# EAGLE design temp-pres (EAGLE 7.6.0)
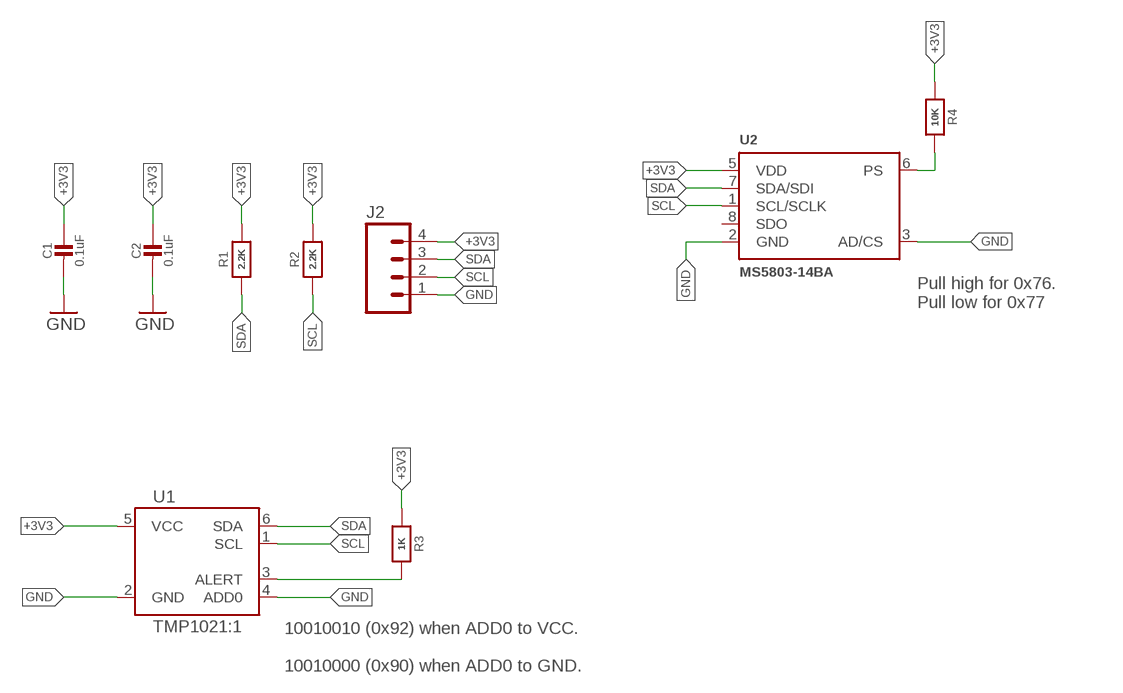
[diagram p0: schematic, sheet 1]

## Parts
C1  0.1uF  CAP_CERAMIC0805-NOOUTLINE  [0805-NO]
C2  0.1uF  CAP_CERAMIC0805-NOOUTLINE  [0805-NO]
J2  M04NO_SILK_ALL_ROUND  [1X04_NO_SILK_ALL_ROUND]
R1  2.2K  RESISTOR_0805MP  [_0805MP]
R2  2.2K  RESISTOR_0805MP  [_0805MP]
R3  1K  RESISTOR_0805MP  [_0805MP]
R4  10K  RESISTOR_0805MP  [_0805MP]
U1  TMP1021:1  [SOT563-2]
U2  MS5803-14BA  [MS5803]

## Nets
+3V3: C1.1 C2.1 J2.4 R1.2 R2.2 R3.1 R4.1 U1.5(VCC) U2.5(VDD)
GND: C1.2 C2.2 J2.1 U1.2(GND) U1.4(ADD0) U2.2(GND) U2.3(AD/CS)
N$1: R3.2 U1.3(ALERT)
PS: R4.2 U2.6(PS)
SCL: J2.2 R2.1 U1.1(SCL) U2.1(SCL/SCLK)
SDA: J2.3 R1.1 U1.6(SDA) U2.7(SDA/SDI)
Unconnected: U2.8(SDO)

## Notes on the sheet
- Pull high for 0x76.
  Pull low for 0x77
- 10010010 (0x92) when ADD0 to VCC.
  
  10010000 (0x90) when ADD0 to GND.

## Library data of the parts
C1 C2 = microbuilder:CAP_CERAMIC: Ceramic Capacitors For new designs, use the packages preceded by an '_' character since they are more reliable: The following footprints should be used on most boards: _0402 - Standard footprint for regular board layouts _0603 - Standard footprint for regular board layouts _0805 - Standard footprint for regular board layouts _1206 - Standard footprint for regular board layouts For extremely tight-pitch boards where space is at a premium, the following 'micro-pitch' footprints can be used (smaller pads, no silkscreen outline, etc.): _0402MP - Micro-pitch footprint for very dense/compact boards _0603MP - Micro-pitch footprint for very dense/compact boards _0805MP - Micro-pitch footprint for very dense/compact boards _1206MP - Micro-pitch footprint for very dense/compact boards
J2 = SparkFun-Connectors:M04: Header 4 Standard 4-pin 0.1" header. Use with straight break away headers (SKU : PRT-00116), right angle break away headers (PRT-00553), swiss pins (PRT-00743), machine pins (PRT-00117), and female headers (PRT-00115). Molex polarized connector foot print use with SKU : PRT-08231 with associated crimp pins and housings. 1MM SMD Version SKU: PRT-10208; PROD_ID: CONN-09696
R1-R4 = microbuilder:RESISTOR: Resistors For new designs, use the packages preceded by an '_' character since they are more reliable: The following footprints should be used on most boards: _0402 - Standard footprint for regular board layouts _0603 - Standard footprint for regular board layouts _0805 - Standard footprint for regular board layouts _1206 - Standard footprint for regular board layouts For extremely tight-pitch boards where space is at a premium, the following 'micro-pitch' footprints can be used (smaller pads, no silkscreen outline, etc.): _0402MP - Micro-pitch footprint for very dense/compact boards _0603MP - Micro-pitch footprint for very dense/compact boards _0805MP - Micro-pitch footprint for very dense/compact boards _1206MP - Micro-pitch footprint for very dense/compact boards
U1 = SparkFun-Sensors:TMP102: I2C degC temp sensor
U2 = MS5803:MS5803-14BA; PROD_ID: IC-12111

## Board
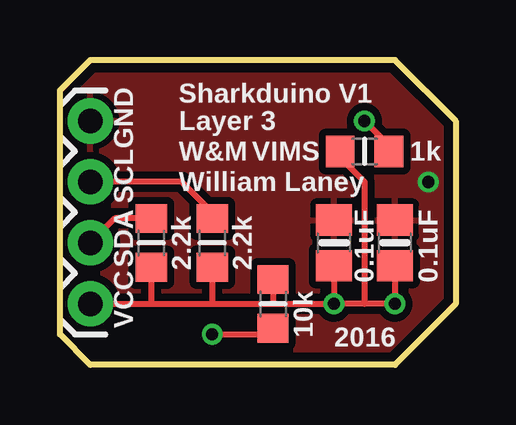
[diagram p1: board, top side]
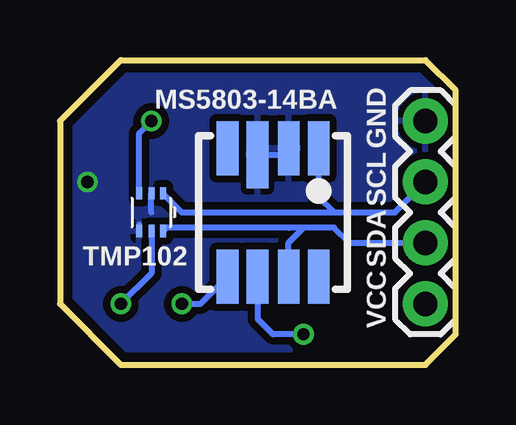
[diagram p2: board, bottom side, seen from below]

Size 16.51 x 12.7 mm. Coordinates in mm from the lower left corner, seen from the top.
Outline: 0,1.27 0,11.43 1.27,12.7 13.97,12.7 16.51,10.16 16.51,2.54 13.97,0 1.27,0 0,1.27
Copper layers (1*16): Top 0.0356mm / dielectric 1.5011mm / Bottom 0.0356mm
Design rules "oshpark-2layer": minimum track width 6mil, minimum drill 13mil, track to track 6mil, track to pad 6mil, pad to pad 6mil, via to via 6mil, smd to smd 6mil, copper to edge 15mil, drill to drill 6mil, minimum pad ring 7mil, minimum via ring 7mil, stop-mask expansion 2.5mil, vias tented up to drill 0mil, thermal gap 10mil

### Footprints (pad centres in the part's own frame; a part is rotated, then mirrored left to right if it is on the bottom)
0805-NO = smd 1.3 x 1.5: 1 -0.95,0; 2 0.95,0
1X04_NO_SILK_ALL_ROUND = drill 1.016 pad 1.88: 1 0,0; 2 2.54,0; 3 5.08,0; 4 7.62,0
_0805MP = smd 1.2 x 1.3: 1 -1.016,0; 2 1.016,0
SOT563-2 = smd 0.508 x 0.249: 1 -0.8,0.498; 2 -0.8,0.003; 3 -0.8,-0.506; 4 0.776,-0.506; 5 0.776,0.003; 6 0.776,0.498
MS5803 = smd 2.25 x 0.9: 1 -2.675,1.9; 2 -2.675,0.65; 4 -2.675,-1.9; 5 2.675,-1.9; 6 2.675,-0.65; 7 2.675,0.65; 8 2.675,1.9 | smd 2.8 x 0.9: 3 -2.4,-0.65

### Placement (x,y rotation side)
C1  11.43,5.08 90 top
C2  13.97,5.08 90 top
J2  1.27,10.16 270 top
R1  3.81,5.08 270 top
R2  6.35,5.08 270 top
R3  12.7,8.89 0 top
R4  8.89,2.54 270 top
U1  12.7,6.35 270 bottom
U2  7.62,6.35 270 bottom

### Tracks (layer width: path | path; a pad name or v marks a point on that pad's centre or on a via)
+3V3  (via drill 0.51)
  Top 0.254: C1.1 v11.43,2.54 | 3.81,2.54 6.35,2.54 | 6.35,2.54 8.89,2.54 | 8.89,2.54 v11.43,2.54 | R1.2 3.81,2.54 | R2.2 6.35,2.54 | C2.1 v13.97,2.54 12.7,2.54 | 12.7,2.54 v11.43,2.54 | R3.1 11.43,8.89 12.7,7.62 12.7,2.54 | R4.1 8.89,2.54 | J2.4 3.81,2.54
  Bottom 0.254: v11.43,2.54 10.65,2.54 U2.5 | U1.5 12.7,3.81 v13.97,2.54
GND  (via drill 0.51)
  Bottom 0.254: U2.2 7.25,8.75 U2.3 8.27,8.24 | U1.4 13.21,5.84 | 12.7,6.35 U1.2
  other vias: 15.37,7.62
  pour Top (isolate 0.305): 0,11.43 0,1.27 1.27,0 13.97,0 16.51,2.54 16.51,10.16 13.97,12.7 1.27,12.7
  pour Bottom (isolate 0.305): 1.52,12.7 13.97,12.7 16.51,10.16 16.51,2.54 13.97,0 1.14,0 1.14,0.13 0,1.27 0,11.43 1.27,12.7
N$1  (via drill 0.51)
  Top 0.254: 13.97,8.64 R3.2 13.72,9.14 v12.7,10.16
  Bottom 0.254: U1.3 13.21,9.65 v12.7,10.16
PS  (via drill 0.51)
  Top 0.254: v6.35,1.27 8.64,1.27 R4.2
  Bottom 0.254: v6.35,1.27 7.62,1.27 8.26,1.91 8.26,3.66 U2.6
SCL
  Top 0.254: R2.1 6.35,6.35 5.08,7.62 J2.2
  Bottom 0.254: U1.1 12.2,7.12 11.43,6.35 5.08,6.35 | 5.08,6.35 2.54,6.35 J2.2 | U2.1 5.72,6.99 5.08,6.35
SDA
  Top 0.254: R1.1 2.29,6.1 J2.3
  Bottom 0.254: 6.35,5.71 5.08,5.71 4.45,5.08 J2.3 | 6.35,5.71 6.99,5.71 | 6.99,5.71 12.06,5.71 U1.6 | 6.97,5.7 6.99,5.71 | U2.7 6.97,5.09 6.35,5.71

### Text on the board
tPlace: Sharkduino V1 | Layer 3 | GND | W&M | VIMS | 1k | SCL | William Laney | SDA | 2.2k | 2.2k | 0.1uF | 0.1uF | VCC | 10k | 2016
bPlace: MS5803-14BA | GND | SCL | TMP102 | SDA | VCC